# EAGLE design Cell Temp Controller v1.0 (EAGLE 7.2.0)
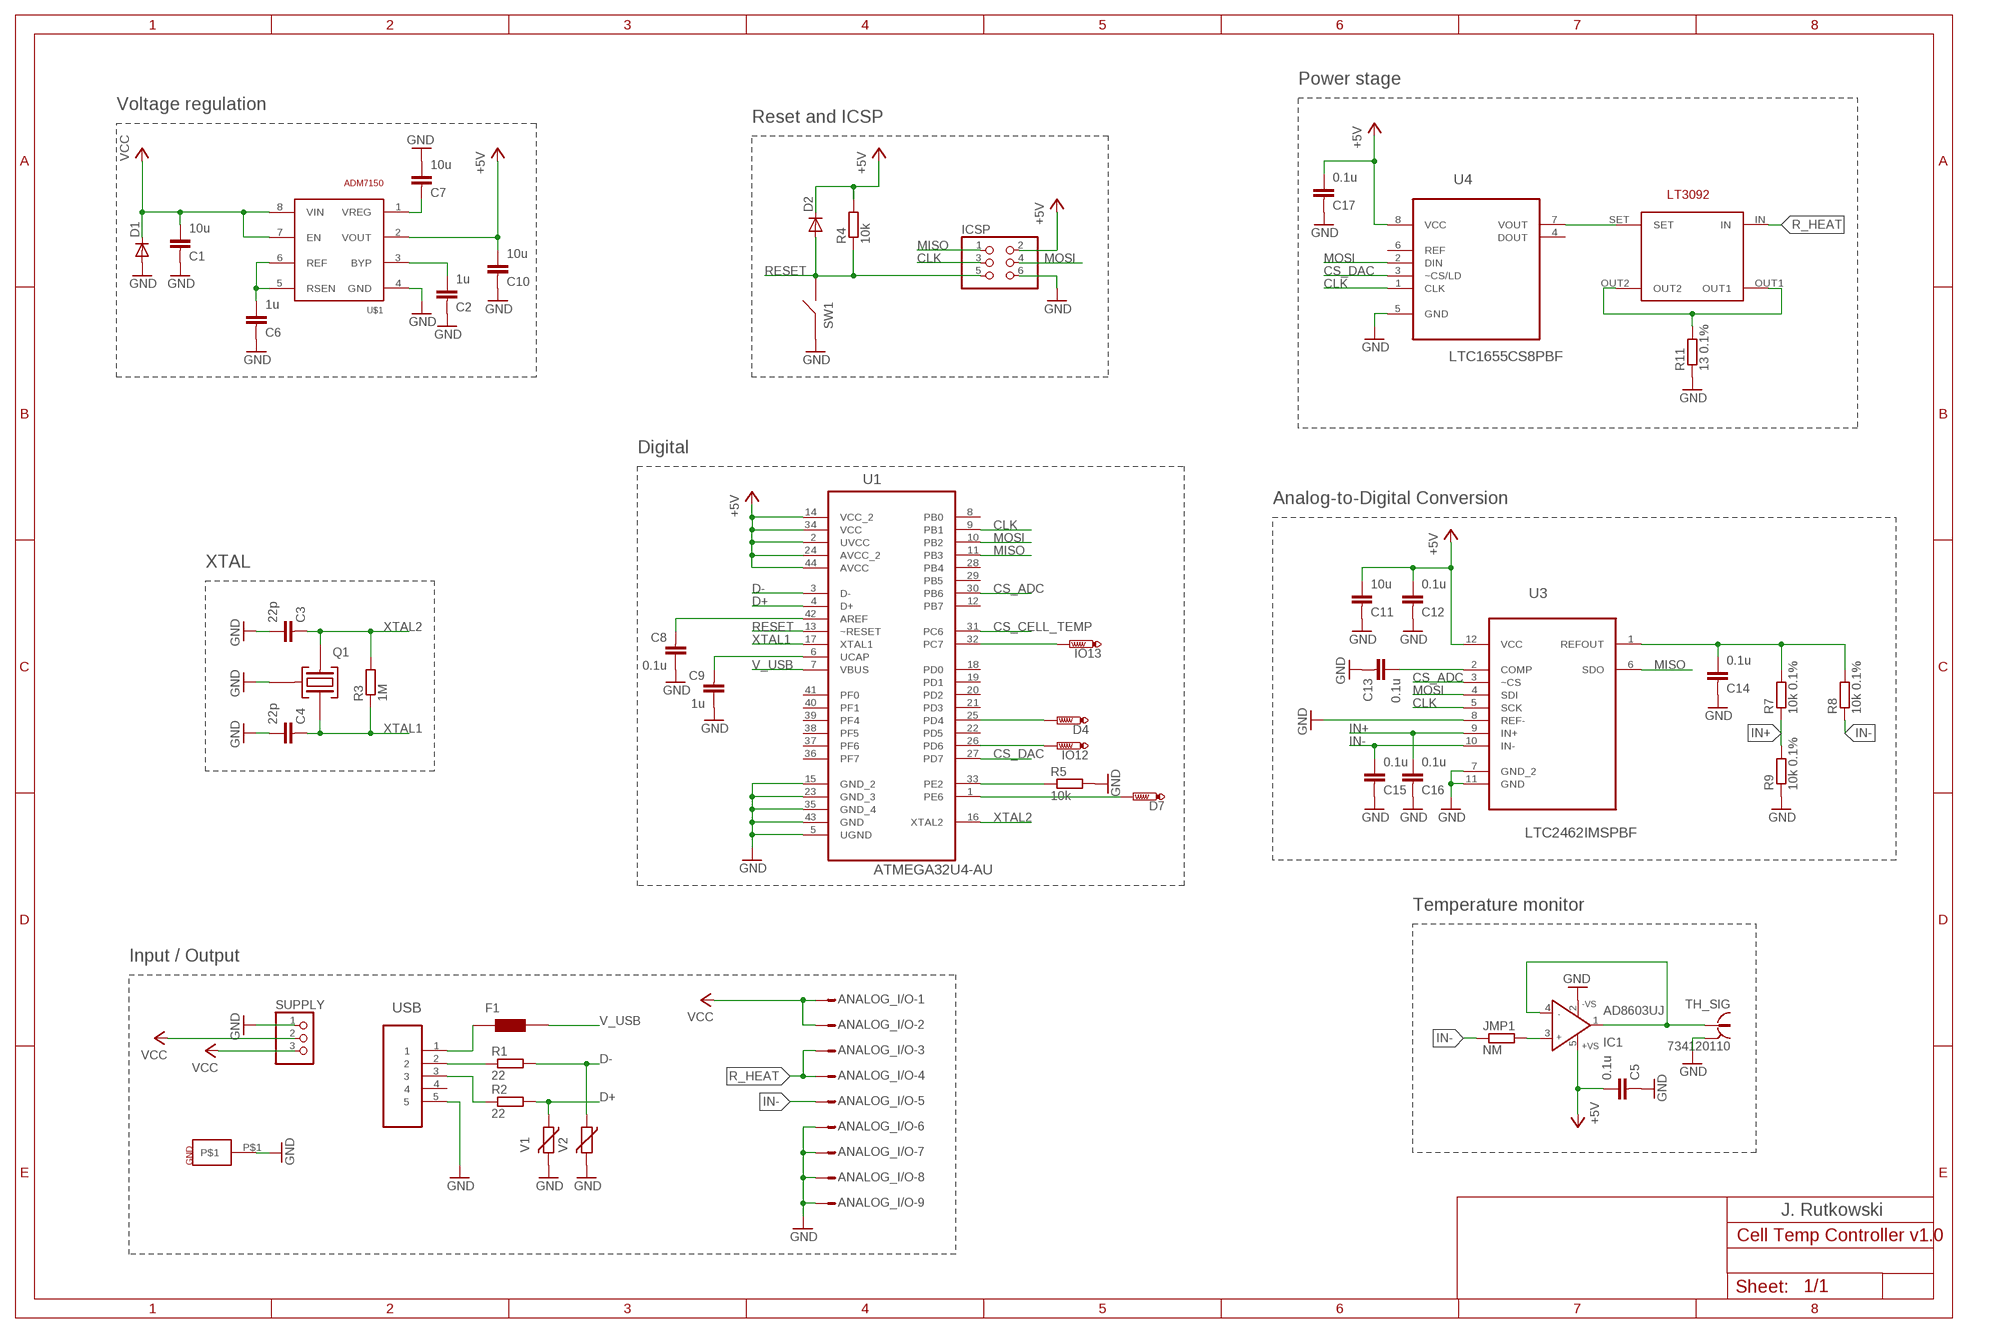
[diagram p0: schematic, sheet 1]

## Parts
ANALOG_I/O  M09HPS  [M09HP]
C1  10u  C-EUC0603K  [C0603K]
C2  1u  C-EUC0603K  [C0603K]
C3  22p  C-EUC0603K  [C0603K]
C4  22p  C-EUC0603K  [C0603K]
C5  0.1u  C-EUC0603K  [C0603K]
C6  1u  C-EUC0603K  [C0603K]
C7  10u  C-EUC0603K  [C0603K]
C8  0.1u  C-EUC0603K  [C0603K]
C9  1u  C-EUC0603K  [C0603K]
C10  10u  C-EUC0603K  [C0603K]
C11  10u  C-EUC0603K  [C0603K]
C12  0.1u  C-EUC0603K  [C0603K]
C13  0.1u  C-EUC0603K  [C0603K]
C14  0.1u  C-EUC0603K  [C0603K]
C15  0.1u  C-EUC0603K  [C0603K]
C16  0.1u  C-EUC0603K  [C0603K]
C17  0.1u  C-EUC0603K  [C0603K]
D1  DIODE-SOD123  [SOD123]
D2  DIODE-SOD123  [SOD123]
D4  PTR1PAD1-13  [P1-13]
D7  PTR1PAD1-13  [P1-13]
F1  FUSE  [C1812]
IC1  AD8603UJ  [SOT23-5]
ICSP  PINHD-2X3  [2X03]
IO12  PTR1PAD1-13  [P1-13]
IO13  PTR1PAD1-13  [P1-13]
JMP1  NM  R-EU_R0402  [R0402]
Q1  CX2520SB  [QUARTZ]
R1  22  R-EU_R0603  [R0603]
R2  22  R-EU_R0603  [R0603]
R3  1M  R-EU_R0603  [R0603]
R4  10k  R-EU_R0603  [R0603]
R5  10k  R-EU_R0603  [R0603]
R7  10k 0.1%  R-EU_R0603  [R0603]
R8  10k 0.1%  R-EU_R0603  [R0603]
R9  10k 0.1%  R-EU_R0603  [R0603]
R11  13 0.1%  R-EU_R2010  [R2010]
SUPPLY  PINHD-1X3  [1X03]
SW1  B3U-1000P  [B3U-1000P]
TH_SIG  734120110  [734120110]
U1  ATMEGA32U4-AU  [QFP80P1200X1200X120-44N]
U3  LTC2462IMSPBF  [SOP65P490X110-12N]
U4  LTC1655CS8PBF  [SOIC127P600X175-8N]
U$1  ADM7150  [SO8]
U$2  LT3092  [SOT-223]
U$3  GND_PAD  [GND_PAD]
USB  47346-0001  [MOLEX_47346-0001]
V1  VARISTORCN0603  [CT/CN0603]
V2  VARISTORCN0603  [CT/CN0603]

## Nets
+5V: C5.1 C10.1 C11.1 C12.1 C17.1 D2.C IC1.5(+VS) ICSP.2 R4.2 U1.2(UVCC) U1.14(VCC_2) U1.24(AVCC_2) U1.34(VCC) U1.44(AVCC) U3.12(VCC) U4.8(VCC) U$1.2(VOUT)
CLK: ICSP.3 U1.9(PB1) U3.5(SCK) U4.1(CLK)
CS_ADC: U1.30(PB6) U3.3(~CS)
CS_CELL_TEMP: U1.31(PC6)
CS_DAC: U1.27(PD7) U4.3(~CS/LD)
D+: R2.2 U1.4(D+) V1.1
D-: R1.2 U1.3(D-) V2.1
GND: ANALOG_I/O.6 ANALOG_I/O.7 ANALOG_I/O.8 ANALOG_I/O.9 C1.2 C2.2 C3.1 C4.1 C5.2 C6.2 C7.1 C8.1 C9.1 C10.2 C11.2 C12.2 C13.2 C14.2 C15.2 C16.2 C17.2 D1.A IC1.2(-VS) ICSP.6 Q1.2(GND) R5.2 R9.1 R11.1 SUPPLY.1 SW1.1 TH_SIG.S@1 TH_SIG.S@2 TH_SIG.S@3 U1.5(UGND) U1.15(GND_2) U1.23(GND_3) U1.35(GND_4) U1.43(GND) U3.7(GND_2) U3.8(REF-) U3.11(GND) U4.5(GND) U$1.4(GND) U$3.P$1 USB.5 V1.2 V2.2
IN+: C16.1 R7.1 R9.2 U3.9(IN+)
IN-: ANALOG_I/O.5 C15.1 JMP1.1 R8.1 U3.10(IN-)
MISO: ICSP.1 U1.11(PB3) U3.6(SDO)
MOSI: ICSP.4 U1.10(PB2) U3.4(SDI) U4.2(DIN)
N$1: F1.2(XTAL2) USB.1
N$2: R1.1 USB.2
N$3: R2.1 USB.3
N$4: U4.7(VOUT) U$2.SET
N$5: C8.2 U1.42(AREF)
N$6: C9.2 U1.6(UCAP)
N$7: R5.1 U1.33(PE2)
N$8: IO13.TP U1.32(PC7)
N$9: D7.TP U1.1(PE6)
N$10: C13.1 U3.2(COMP)
N$11: C14.1 R7.2 R8.2 U3.1(REFOUT)
N$12: D4.TP U1.25(PD4)
N$13: IC1.1(OUT) IC1.4(IN-) TH_SIG.1
N$14: IC1.3(IN+) JMP1.2
N$15: R11.2 U$2.OUT1 U$2.OUT2
N$16: IO12.TP U1.26(PD6)
N$17: C6.1 U$1.5(RSEN) U$1.6(REF)
N$18: C7.2 U$1.1(VREG)
N$19: C2.1 U$1.3(BYP)
R_HEAT: ANALOG_I/O.3 ANALOG_I/O.4 U$2.IN
RESET: D2.A ICSP.5 R4.1 SW1.2 U1.13(~RESET)
V_USB: F1.1(XTAL1) U1.7(VBUS)
VCC: ANALOG_I/O.1 ANALOG_I/O.2 C1.1 D1.C SUPPLY.2 SUPPLY.3 U$1.7(EN) U$1.8(VIN)
XTAL1: C4.2 Q1.3(XTAL2) R3.1 U1.17(XTAL1)
XTAL2: C3.2 Q1.1(XTAL1) R3.2 U1.16(XTAL2)
Unconnected: U1.8(PB0) U1.12(PB7) U1.18(PD0) U1.19(PD1) U1.20(PD2) U1.21(PD3) U1.22(PD5) U1.28(PB4) U1.29(PB5) U1.36(PF7) U1.37(PF6) U1.38(PF5) U1.39(PF4) U1.40(PF1) U1.41(PF0) U4.4(DOUT) U4.6(REF) USB.4

## Notes on the sheet
- Power stage
- Voltage regulation
- Reset and ICSP
- Digital
- Analog-to-Digital Conversion
- XTAL
- Temperature monitor
- Input / Output
- J. Rutkowski

## Library data of the parts
ANALOG_I/O = con-subd:M09?S: SUB-D; OC_FARNELL: unknown; OC_NEWARK: unknown
C1-C17 = rcl:C-EU: CAPACITOR, European symbol
D1 D2 = diode:DIODE-: DIODE
D4 D7 IO12 IO13 = testpad:PTR1: TEST PIN
F1 = rcl:FUSE
IC1 = analog-devices:AD8603: Precision Micropower, Low Noise CMOS, Rail-to-Rail Input/Output Operational Amplifiers Source: http://www.analog.com/static/imported-files/data_sheets/AD8603_8607_8609.pdf; MF: ALTERA CORPORATION; MPN: AD8603AUJZ-REEL7; OC_FARNELL: 1651290; OC_NEWARK: 59K6904
ICSP = pinhead:PINHD-2X3: PIN HEADER
JMP1 R1-R5 R7-R9 R11 = rcl:R-EU_: RESISTOR, European symbol
Q1 = Custom-parts:CX2520SB: Crystal Units Surface Mount Type CX2520SB (CX-2520SB); FARNELL_OC: 1368779; MPN: CX5032SB16000F0FLJZZ
SUPPLY = pinhead:PINHD-1X3: PIN HEADER
SW1 = Custom-parts:B3U-1000P: Top-actuated Ultra-small Tactile Switch (SMT) OMRON; MPN: B3U-1000P(M); OC_FARNELL: 1333652
TH_SIG = con-coax:734120110: MICRO COAXIAL CONNECTOR RECEPTACLE VERTICAL Source: Data sheet <http://www.molex.com/pdm_docs/sd/734120110_sd.pdf>
U1 = ATMEGA32:ATMEGA32U4-AU: 8-bit Microcontroller with ISP Flash and USB Controller; MPN: ATMEGA32U4-AU; OC_FARNELL: 1748525; OC_NEWARK: 26R5633; PACKAGE: TQFP-44; SUPPLIER: Atmel
U3 = LTC_By_element14_Batch_1:LTC2462IMSPBF: Ultra-Tiny, 16-Bit ADCs with 10ppm/°C Max Precision Reference; MPN: LTC2462IMS#PBF; OC_FARNELL: -; OC_NEWARK: 24R6602; PACKAGE: MSOP-12; SUPPLIER: Linear Technology
U4 = LTC_By_element14_Batch_1:LTC1655CS8PBF: 16-Bit Rail-to-Rail Micropower DAC; MPN: LTC1655CS8#PBF; OC_FARNELL: 1663654; OC_NEWARK: 56M2907; PACKAGE: SOIC-8; SUPPLIER: Linear Technology
U$1 = Custom-parts:ADM7150
U$2 = LinearTech:LT3092
U$3 = Custom-parts:GND_PAD
USB = Molex-47346-0001:47346-0001: CONN RCPT 5POS MICRO USB R/A SMD; MPN: 47346-0001; OC_FARNELL: 1568026; OC_NEWARK: 47M0505; PACKAGE: 5 POS MICRO USB R/A; SUPPLIER: MOLEX
V1 V2 = varistor:VARISTOR: VARISTOR

## Board
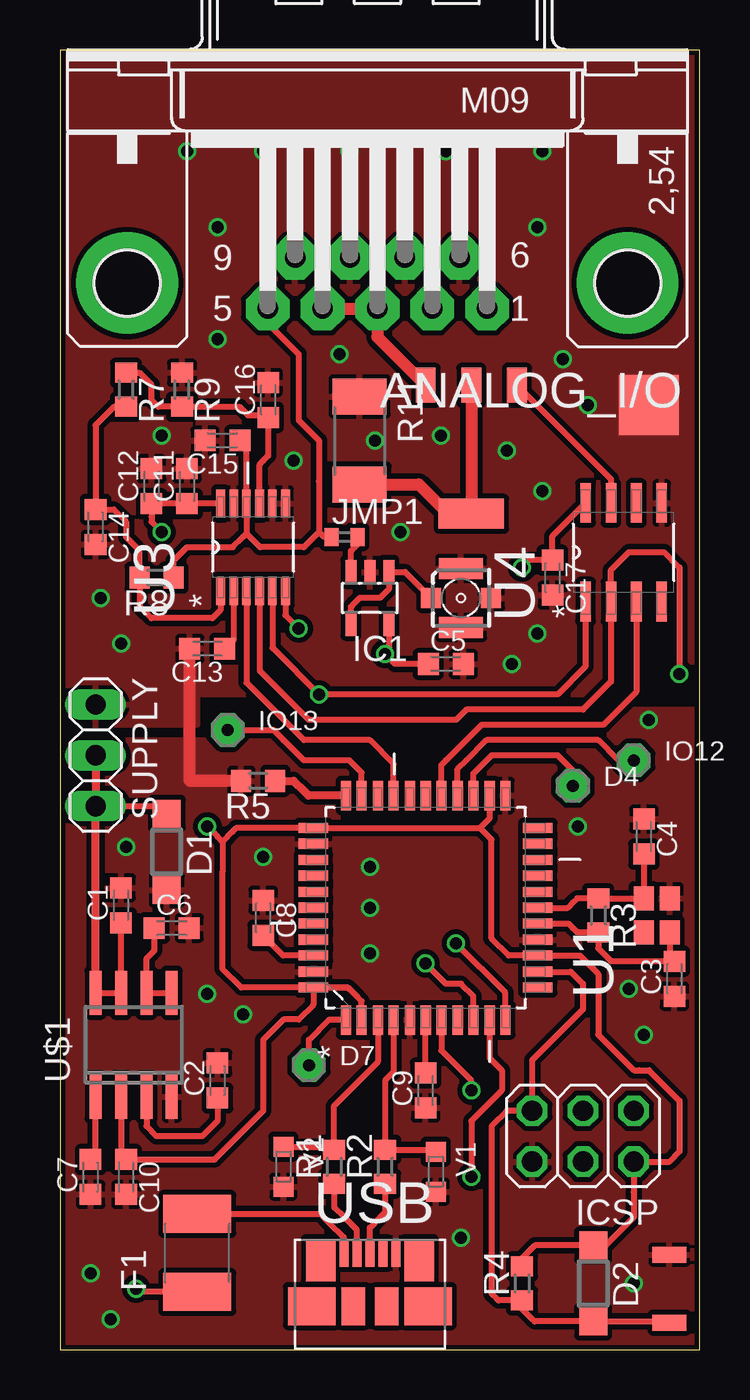
[diagram p1: board, top side]
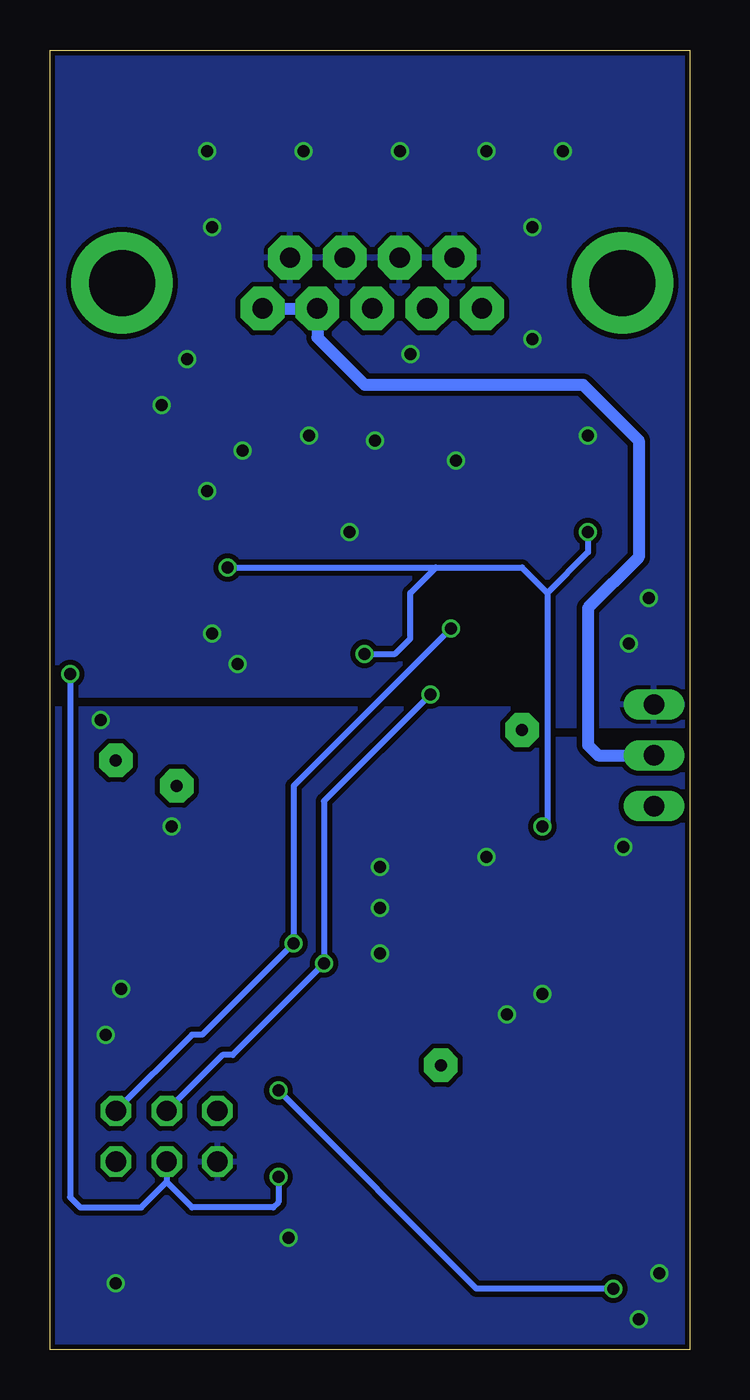
[diagram p2: board, bottom side, seen from below]

Size 32 x 65 mm. Coordinates in mm from the lower left corner, seen from the top.
Outline: 0,0 32,0 32,65 0,65 0,0
Copper layers (1*16): Top 0.018mm / dielectric 1.55mm / Bottom 0.018mm
Design rules "eC_2Layer_PClass6_BaseCopperO18_eCDefault *": minimum track width 0.15mm, minimum drill 0.35mm, track to track 0.15mm, track to pad 0.15mm, pad to pad 0.15mm, via to via 0.15mm, smd to smd 0mil, copper to edge 0.25mm, drill to drill 0.35mm, minimum pad ring 0.175mm, minimum via ring 0.125mm, stop-mask expansion 0mil, vias tented up to drill 0.45mm, thermal gap 0.2mm

### Footprints (pad centres in the part's own frame; a part is rotated, then mirrored left to right if it is on the bottom)
M09HP = drill 1.016 pad 2.184 octagon: 1 -5.486,1.27; 2 -2.743,1.27; 3 0,1.27; 4 2.743,1.27; 5 5.486,1.27; 6 -4.115,-1.27; 7 -1.372,-1.27; 8 1.372,-1.27; 9 4.115,-1.27 | drill 3.302 pad 5.08: G1 -12.522,0; G2 12.522,0
C0603K = smd 1.05 x 1.08: 1 -0.875,0; 2 0.875,0
SOD123 = smd 1.4 x 1.4: A 1.9,0; C -1.9,0
P1-13 = drill 0.6 pad 1.676 octagon: TP 0,0
C1812 = smd 1.9 x 3.4: 1 -1.95,0; 2 1.95,0
SOT23-5 = smd 0.55 x 1.2: 1 -0.95,-1.3; 2 0,-1.3; 3 0.95,-1.3; 4 0.95,1.3; 5 -0.95,1.3
2X03 = drill 1.016 octagon: 1 -2.54,-1.27; 2 -2.54,1.27; 3 0,-1.27; 4 0,1.27; 5 2.54,-1.27; 6 2.54,1.27
R0402 = smd 0.7 x 0.9: 1 -0.65,0; 2 0.65,0
QUARTZ = smd 1.2 x 1: 1 -0.85,-0.65; 2 0.85,-0.65; 3 0.85,0.65; 4 -0.85,0.65
R0603 = smd 1 x 1.1: 1 -0.85,0; 2 0.85,0
R2010 = smd 1.8 x 2.7: 1 -2.2,0; 2 2.2,0
1X03 = drill 1.016 long: 1 -2.54,0; 2 0,0; 3 2.54,0
B3U-1000P = smd 0.8 x 1.7: 1 -1.7,0; 2 1.7,0
734120110 = smd 1 x 1: 1 0,-1.5; S@1 0,1.5 | smd 1.05 x 2.2: S@2 -1.475,0; S@3 1.475,0
QFP80P1200X1200X120-44N = smd 1.473 x 0.508: 1 -5.613,3.988; 2 -5.613,3.2; 3 -5.613,2.388; 4 -5.613,1.6; 5 -5.613,0.787; 6 -5.613,0; 7 -5.613,-0.787; 8 -5.613,-1.6; 9 -5.613,-2.388; 10 -5.613,-3.2; 11 -5.613,-3.988; 23 5.613,-3.988; 24 5.613,-3.2; 25 5.613,-2.388; 26 5.613,-1.6; 27 5.613,-0.787; 28 5.613,0; 29 5.613,0.787; 30 5.613,1.6; 31 5.613,2.388; 32 5.613,3.2; 33 5.613,3.988 | smd 0.508 x 1.473: 12 -3.988,-5.613; 13 -3.2,-5.613; 14 -2.388,-5.613; 15 -1.6,-5.613; 16 -0.787,-5.613; 17 0,-5.613; 18 0.787,-5.613; 19 1.6,-5.613; 20 2.388,-5.613; 21 3.2,-5.613; 22 3.988,-5.613; 34 3.988,5.613; 35 3.2,5.613; 36 2.388,5.613; 37 1.6,5.613; 38 0.787,5.613; 39 0,5.613; 40 -0.787,5.613; 41 -1.6,5.613; 42 -2.388,5.613; 43 -3.2,5.613; 44 -3.988,5.613
SOP65P490X110-12N = smd 1.397 x 0.432: 1 -2.184,1.626; 2 -2.184,0.965; 3 -2.184,0.33; 4 -2.184,-0.33; 5 -2.184,-0.965; 6 -2.184,-1.626; 7 2.184,-1.626; 8 2.184,-0.965; 9 2.184,-0.33; 10 2.184,0.33; 11 2.184,0.965; 12 2.184,1.626
SOIC127P600X175-8N = smd 1.981 x 0.533: 1 -2.464,1.905; 2 -2.464,0.635; 3 -2.464,-0.635; 4 -2.464,-1.905; 5 2.464,-1.905; 6 2.464,-0.635; 7 2.464,0.635; 8 2.464,1.905
SO8 = smd 0.6 x 2.2: 1 -1.905,-2.6; 2 -0.635,-2.6; 3 0.635,-2.6; 4 1.905,-2.6; 5 1.905,2.6; 6 0.635,2.6; 7 -0.635,2.6; 8 -1.905,2.6
SOT-223 = smd 0.991 x 1.753: IN 2.286,-3.277; OUT2 0,-3.277; SET -2.286,-3.277 | smd 3.277 x 1.499: OUT1 0,3.15
GND_PAD = smd 3 x 3: P$1 0,0
MOLEX_47346-0001 = smd 0.45 x 1.38: 1 -1.3,0; 2 -0.65,0; 3 0,0; 4 0.65,0; 5 1.3,0 | smd 1.475 x 2.1: M1 -2.462,-0.36; M2 2.462,-0.36 | smd 2.375 x 1.9: M3 -2.913,-2.66; M6 2.913,-2.66 | smd 1.175 x 1.9: M4 -0.82,-2.66; M5 0.85,-2.66
CT/CN0603 = smd 1 x 1: 1 -1,0; 2 1,0

### Placement (x,y rotation side)
ANALOG_I/O  15.88,53.34 180 top
C1  3.05,22.23 90 top
C2  7.87,13.46 90 top
C3  30.73,18.54 90 top
C4  29.21,25.65 270 top
C5  19.3,34.29 0 top
C6  5.59,21.08 0 top
C7  1.52,8.64 90 top
C8  10.16,21.59 270 top
C9  18.29,12.95 90 top
C10  3.3,8.64 270 top
C11  6.35,43.18 90 top
C12  4.57,43.18 90 top
C13  7.37,35.05 180 top
C14  1.78,41.15 270 top
C15  8.13,45.47 180 top
C16  10.41,47.5 90 top
C17  24.64,38.61 270 top
D1  5.33,24.89 270 top
D2  26.67,3.3 270 top
D4  25.65,28.19 0 top
D7  12.45,14.22 0 top
F1  6.86,4.83 90 top
IC1  15.49,37.59 180 top
ICSP  26.16,10.67 180 top
IO12  28.7,29.46 0 top
IO13  8.38,30.99 0 top
JMP1  14.22,40.64 0 top
Q1  29.84,21.72 90 top
R1  13.72,9.14 90 top
R2  16.26,9.14 90 top
R3  26.92,21.72 270 top
R4  23.11,3.3 90 top
R5  9.91,28.45 180 top
R7  3.3,48.01 270 top
R8  4.83,38.61 180 top
R9  6.1,48.01 270 top
R11  14.99,45.47 270 top
SUPPLY  1.78,29.72 270 top
SW1  30.48,3.05 270 top
TH_SIG  20.07,37.59 270 top
U1  18.29,22.1 90 top
U3  9.65,40.13 90 top
U4  28.19,39.88 90 top
U$1  3.68,15.24 0 top
U$2  20.57,44.96 180 top
U$3  29.46,47.24 0 top
USB  15.49,4.83 0 top
V1  18.8,8.89 270 top
V2  11.18,9.14 270 top

### Tracks (layer width: path | path; a pad name or v marks a point on that pad's centre or on a via)
+5V  (via drill 0.6)
  Top 0.305: U4.8 24.64,40.69 C17.1 23.48,39.48 v23.11,39.12 | 8.13,25.4 8.64,25.91 8.81,26.09 U1.34 21.01,26.09 | 8.13,25.4 8.13,23.88 8.13,23.11 8.13,19.05 9.07,18.11 14.4,18.11 | 21.01,26.09 21.08,26.16 21.49,26.57 U1.24 | 21.01,26.09 21.59,25.5 21.59,20.57 22.45,19.71 U1.14 25.5,19.71 26.01,19.71 26.92,18.8 26.92,15.75 28.7,13.97 28.96,13.97 29.46,13.97 30.99,12.45 30.99,9.91 30.48,9.4 ICSP.2 28.7,7.87 28.7,6.6 27.3,5.2 D2.C 23.74,5.2 23.62,5.08 23.11,4.57 R4.2 | U1.2 15.09,17.42 | 15.09,17.42 14.73,17.78 14.48,18.03 | 14.4,18.11 U1.44 12.68,17.25 11.94,16.51 11.18,16.51 10.16,15.49 10.16,11.94 7.87,9.65 7.73,9.51 C10.1 3.05,9.77 U$1.2 | C12.1 C11.1 6.36,42.32 U3.12 4.57,42.32 4.57,41.66 4.57,41.4 v5.08,40.89 | v7.37,26.16 7.87,25.65 8.13,25.4 | IC1.5 16.44,34.99 v16.26,34.8 16.76,34.29 C5.1 | 15.09,17.42 14.48,18.03 | 14.48,18.03 14.4,18.11
  Bottom 0.305: v5.08,40.89 5.08,39.88 7.11,37.85 | 7.11,37.85 7.11,26.42 v7.37,26.16 | v23.11,39.12 12.7,39.12 | 12.7,39.12 8.38,39.12 7.11,37.85 | v16.26,34.8 14.73,34.8 13.97,35.56 13.97,37.85 12.7,39.12
CLK  (via drill 0.6)
  Top 0.305: U1.9 20.68,17.68 20.07,18.29 19.3,18.29 v18.29,19.3 | U3.5 10.62,35.1 10.67,35.05 v12.95,32.77 19.56,32.77 20.32,32.77 20.57,32.77 24.89,32.77 26.29,34.16 U4.1
  Bottom 0.305: ICSP.3 23.37,14.73 22.86,14.73 v18.29,19.3 18.29,27.43 v12.95,32.77
CS_ADC
  Top 0.305: U1.30 16.69,29.29 15.49,30.48 12.19,30.48 9.32,33.35 U3.3
CS_DAC
  Top 0.305: U4.3 28.83,32.89 27.18,31.24 21.08,31.24 19.3,29.46 19.07,29.23 U1.27
D+
  Top 0.305: U1.4 16.69,13.89 16.26,13.46 R2.2 18.69,9.99 V1.1
D-
  Top 0.305: U1.3 15.9,14.38 14.48,12.95 13.72,12.19 R1.2 13.57,10.14 V2.1
GND  (via drill 0.6)
  Top 0.61: R5.2 6.49,28.45 C13.2
  other vias: 6.35,59.94 10.16,59.94 14.48,59.94 19.3,59.94 24.13,59.94 23.88,56.13 7.87,56.13 7.87,50.55 5.08,45.72 11.68,44.45 19.05,45.72 22.35,44.96 25.15,49.53 26.42,47.24 24.13,42.93 17.02,40.89 23.88,35.81 2.03,37.59 3.05,35.31 3.3,25.15 7.37,17.78 9.14,16.76 10.16,24.64 1.52,3.81 2.54,1.52 20.07,5.59 28.7,3.3 15.49,19.81 15.49,22.1 15.49,24.13 25.91,26.16 29.46,31.5 28.45,18.03 29.21,15.75 22.61,34.29 13.97,49.78 15.75,45.47
  pour Top (isolate 0.254): 0.25,31.24 0.25,64.77 31.75,64.77 31.75,32.77 6.86,32.77 6.86,31.24
  pour Top (isolate 0.254): 0.25,30.48 7.62,30.48 7.62,32 31.75,32 31.75,0.25 0.25,0.25
  pour Bottom (isolate 0.254): 0.25,64.77 31.75,64.77 31.75,32.77 6.86,32.77 6.86,31.24 0.25,31.24
  pour Bottom (isolate 0.254): 0.25,30.48 7.62,30.48 7.62,32 31.75,32 31.75,0.25 0.25,0.25
  pour Top (isolate 0.254, no thermals): 26.16,49.53 31.75,49.53 31.75,44.96 26.16,44.96
IN+
  Top 0.305: R7.1 3.98,48.86 4.32,48.51 4.57,48.26 4.57,47.5 4.91,47.16 R9.2 8.98,47.16 9.4,46.74 10.3,46.74 C16.1 10.41,44.7 10.16,44.45 9.98,44.27 U3.9
IN-
  Top 0.305: R8.1 5.68,39.46 6.35,40.13 8.64,40.13 9.14,40.64 9.32,40.82 | 9.32,40.82 U3.10 9.32,45.15 C15.1 | ANALOG_I/O.5 10.39,51.33 11.94,49.78 11.94,46.48 12.95,45.47 12.95,43.43 12.95,40.89 | 12.95,40.89 12.19,40.13 10.01,40.13 9.32,40.82 | JMP1.1 13.21,40.64 12.95,40.89
MISO  (via drill 0.6)
  Top 0.305: U1.11 22.28,17.86 v19.81,20.32 | U3.6 11.28,36.73 v11.94,36.07
  Bottom 0.305: ICSP.1 24.89,15.75 24.38,15.75 v19.81,20.32 19.81,28.19 v11.94,36.07
MOSI  (via drill 0.6)
  Top 0.305: U1.10 21.49,14.58 22.1,13.97 22.1,12.95 21.59,12.45 20.57,11.43 v20.57,8.64 | v30.99,33.78 30.99,39.12 30.23,39.88 28.45,39.88 27.56,38.99 U4.2 27.56,33.4 26.16,32 20.32,32 19.81,31.5 14.99,31.5 12.45,31.5 9.98,33.96 U3.4
  Bottom 0.305: v20.57,8.64 20.57,7.37 20.83,7.11 24.89,7.11 26.16,8.38 | ICSP.4 26.16,8.38 | v30.99,33.78 30.99,7.62 30.48,7.11 27.43,7.11 26.16,8.38
N$1
  Top 0.305: USB.1 14.19,5.62 13.46,6.35 13.04,6.78 F1.2
N$2
  Top 0.305: R1.1 13.72,7.11 14.22,6.6 14.84,5.98 USB.2
N$3
  Top 0.305: USB.3 15.49,6.1 16,6.6 16.26,6.86 R2.1
N$4
  Top 0.305: U$2.SET 27.56,43.54 U4.7
N$5
  Top 0.305: U1.42 11.16,19.71 C8.2
N$6
  Top 0.305: C9.2 U1.6
N$7
  Top 0.406: R5.1 11.68,28.45 12.19,27.94 12.42,27.71 U1.33
N$8
  Top 0.305: U1.32 15.09,28.85 14.48,29.46 12.19,29.46 11.18,30.48 10.67,30.99 IO13.TP
N$9
  Top 0.305: D7.TP 12.45,15.49 13.46,16.51 14.28,16.51 U1.1
N$10
  Top 0.305: U3.2 8.69,35.5 C13.1
N$11
  Top 0.305: U3.1 8.03,36.98 7.62,36.58 4.57,36.58 4.06,37.08 3.98,37.17 R8.2 3.98,39.97 3.81,40.13 3.3,40.64 3.3,41.4 2.68,42.02 C14.1 1.78,46.23 2.71,47.16 R7.2
N$12
  Top 0.305: D4.TP 25.65,28.96 24.89,29.72 21.59,29.72 20.83,28.96 20.68,28.8 U1.25
N$13
  Top 0.305: IC1.4 14.54,37.15 14.73,37.34 14.99,37.59 15.24,37.59 16,37.59 16.44,38.03 IC1.1 17.27,38.89 TH_SIG.1
N$14
  Top 0.305: JMP1.2 14.87,40.27 14.73,40.13 14.54,39.94 IC1.3
N$15
  Top 0.305: 20.47,41.91 U$2.OUT1 20.47,41.91
  Top 0.61: U$2.OUT2 U$2.OUT1 | 20.47,41.91 19.3,41.91 18.67,42.55 | 18.67,42.55 18.29,42.93 | R11.2 17.95,43.27 18.67,42.55
N$16
  Top 0.305: U1.26 19.89,29.03 20.32,29.46 21.34,30.48 26.92,30.48 27.94,29.46 IO12.TP
N$17
  Top 0.305: U$1.5 U$1.6 4.32,19.56 4.57,19.81 4.71,19.95 C6.1
N$18
  Top 0.305: C7.2 1.78,9.77 U$1.1
N$19
  Top 0.305: C2.1 7.87,11.43 7.11,10.67 4.83,10.67 4.32,11.18 U$1.3
R_HEAT
  Top 0.61: ANALOG_I/O.4 ANALOG_I/O.3 15.88,50.65 U$2.IN
RESET
  Top 0.305: SW1.2 30.43,1.4 D2.A 23.74,1.4 23.62,1.52 23.11,2.03 R4.1 21.93,2.45 21.84,2.54 21.59,2.79 21.59,11.18 22.35,11.94 ICSP.5 23.62,14.48 24.64,15.49 26.16,17.02 26.16,18.29 25.55,18.9 U1.13
V_USB  (via drill 0.6)
  Top 0.305: F1.1 3.98,2.88 v3.81,3.05 | v20.57,12.95 20.57,13.46 19.56,14.48 19.07,14.96 U1.7
  Bottom 0.305: v3.81,3.05 10.67,3.05 v20.57,12.95
VCC
  Top 0.305: 5.2,27.18 D1.C 4.95,27.18 SUPPLY.3 | U$1.8 U$1.7 C1.1
  Top 0.406: SUPPLY.2 SUPPLY.3 U$1.8
  Bottom 0.61: ANALOG_I/O.1 ANALOG_I/O.2 18.62,50.62 16.26,48.26 5.33,48.26 2.54,45.47 2.54,39.62 5.08,37.08 5.08,30.23 4.57,29.72 SUPPLY.2
XTAL1
  Top 0.305: U1.17 25.4,22.1 25.65,22.35 25.87,22.57 R3.1 Q1.3 29.21,22.58 C4.2
XTAL2
  Top 0.305: U1.16 25.43,21.31 25.65,21.08 25.87,20.87 R3.2 26.92,20.07 27.43,19.56 27.57,19.42 C3.2 30.5,19.66 Q1.1

### Text on the board
Top_legend: Digital Temperature Controller Rev. 1.0 / FEMTO-ST 2016 | R7 | R9 | C16 | C15 | R11 | U$2 | C12 | C11 | U3 | JMP1 | U4 | R8 | IC1 | Out | C17 | GND | C13 | C5 | IO13 | VCC | IO12 | R5 | D4 | C4 | D1 | R3 | C1 | U1 | C8 | C8 | C6 | Q1 | C3 | D7 | C2 | C9 | U$1 | R1 | R2 | V2 | ICSP | V1 | C7 | C10 | SW1 | F1 | R4 | D2